# EAGLE schematic Battery Shield (EAGLE 6.3)
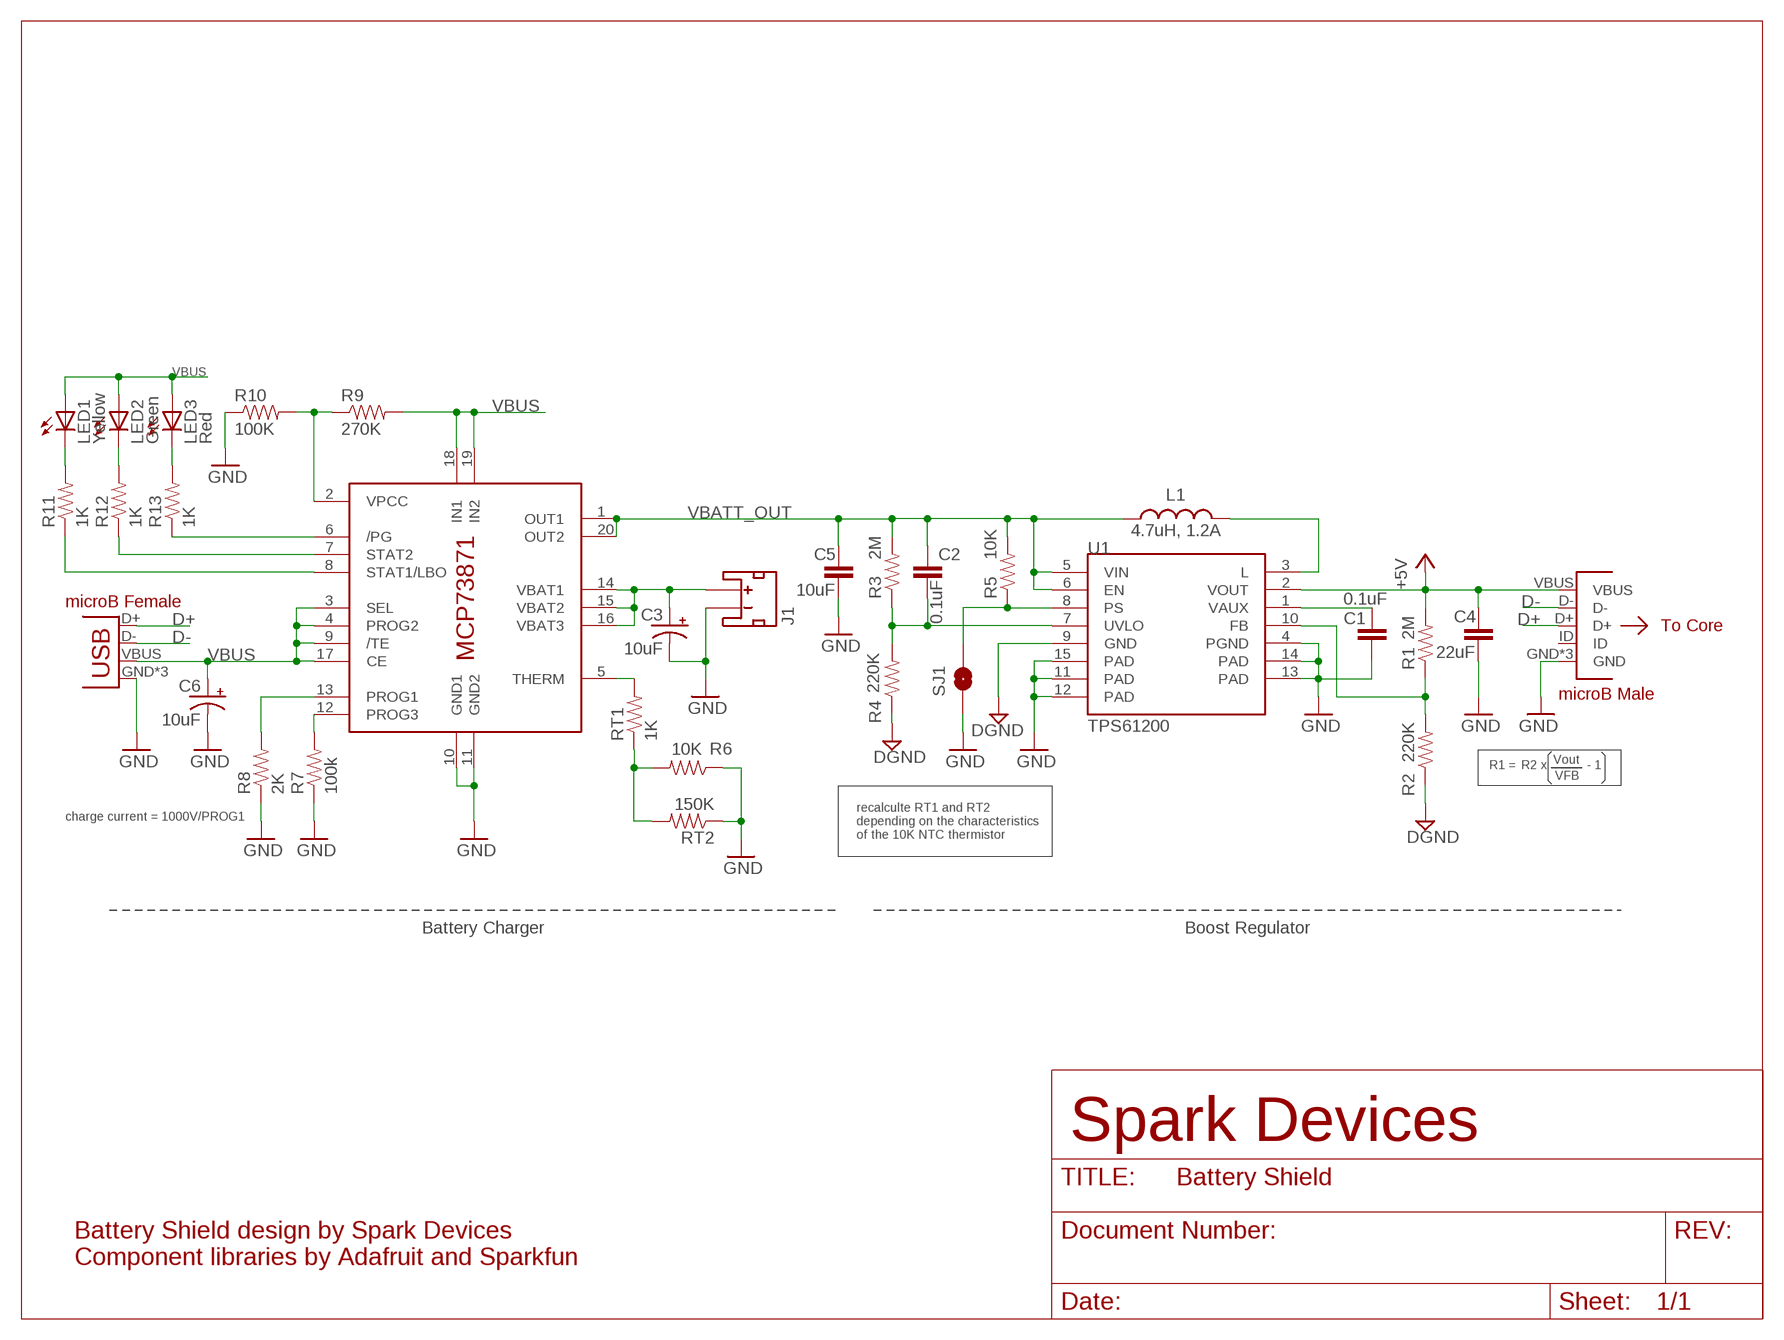
[diagram p0: schematic, sheet 1]

## Parts
C1  0.1uF  CAP0402-CAP  [0402-CAP]
C2  0.1uF  CAP0402-CAP  [0402-CAP]
C3  10uF  10UF-16V-10%(TANT)  [EIA3216]
C4  22uF  CAP0805  [0805]
C5  10uF  CAP1206  [1206]
C6  10uF  10UF-16V-10%(TANT)  [EIA3216]
IC1  MCP73871  [QFN20]
J1  JST_2MM_MALE  [JST-2-SMD]
JP1  USBUSB-MICROB-SLOT-HOLE  [USB-MICROB-SLOT-HOLE]
L1  4.7uH, 1.2A  INDUCTOR.  [CDRH2D09]
LED1  Yellow  LED0603  [LED-0603]
LED2  Green  LED0603  [LED-0603]
LED3  Red  LED0603  [LED-0603]
R1  2M  RESISTOR0402-RES  [0402-RES]
R2  220K  RESISTOR0402-RES  [0402-RES]
R3  2M  RESISTOR0402-RES  [0402-RES]
R4  220K  RESISTOR0402-RES  [0402-RES]
R5  10K  RESISTOR0402-RES  [0402-RES]
R6  10K  RESISTOR0402-RES  [0402-RES]
R7  100k  RESISTOR0402-RES  [0402-RES]
R8  2K  RESISTOR0402-RES  [0402-RES]
R9  270K  RESISTOR0402-RES  [0402-RES]
R10  100K  RESISTOR0402-RES  [0402-RES]
R11  1K  RESISTOR0402-RES  [0402-RES]
R12  1K  RESISTOR0402-RES  [0402-RES]
R13  1K  RESISTOR0402-RES  [0402-RES]
RT1  1K  RESISTOR0402-RES  [0402-RES]
RT2  150K  RESISTOR0402-RES  [0402-RES]
SJ1  SOLDERJUMPERNO  [SJ_2S-NO]
U1  TPS61200  [QFN-10_PAD]
U$1  USB_MALE  [USB-MICROB-MALE-SANDWICH]

## Nets
+5V: C4.1 R1.2 U1.2(VOUT) U$1.VBUS
D+: JP1.D+ U$1.D+
D-: JP1.D- U$1.D-
DGND: R2.1 R4.1 U1.9(GND)
GND: C1.2 C3.C(-) C4.2 C5.2 C6.C(-) IC1.10(GND1) IC1.11(GND2) J1.1(-) JP1.GND JP1.MT1(GND) JP1.MT2(GND) R6.1 R7.1 R8.1 R10.1 RT2.1 SJ1.1 U1.4(PGND) U1.11(PAD) U1.12(PAD) U1.13(PAD) U1.14(PAD) U1.15(PAD) U$1.GND U$1.GNDPAD1(GND) U$1.GNDPAD2(GND)
N$1: L1.P$2 U1.3(L)
N$2: C1.1 U1.1(VAUX)
N$3: C2.2 R3.1 R4.2 U1.7(UVLO)
N$4: R1.1 R2.2 U1.10(FB)
N$5: C3.A(+) IC1.14(VBAT1) IC1.15(VBAT2) IC1.16(VBAT3) J1.2(+)
N$6: IC1.8(STAT1/LBO) R11.1
N$7: R6.2 RT1.1 RT2.2
N$8: LED1.C R11.2
N$9: IC1.5(THERM) RT1.2
N$10: LED2.C R12.2
N$11: IC1.12(PROG3) R7.2
N$12: IC1.2(VPCC) R9.1 R10.2
N$13: IC1.13(PROG1) R8.2
N$14: IC1.7(STAT2) R12.1
N$15: IC1.6(/PG) R13.1
N$16: LED3.C R13.2
N$19: R5.1 SJ1.2 U1.8(PS)
VBATT_OUT: C2.1 C5.1 IC1.1(OUT1) IC1.20(OUT2) L1.P$1 R3.2 R5.2 U1.5(VIN) U1.6(EN)
VBUS: C6.A(+) IC1.3(SEL) IC1.4(PROG2) IC1.9(/TE) IC1.17(CE) IC1.18(IN1) IC1.19(IN2) JP1.VBUS LED1.A LED2.A LED3.A R9.2
Unconnected: J1.NC1(PAD1) J1.NC2(PAD2) U$1.ID

## Notes on the sheet
- microB Female
- To Core
- microB Male
- Vout
- R1 = | R2 | x | - 1
- VFB
- charge current = 1000V/PROG1
- recalculte RT1 and RT2
  depending on the characteristics
  of the 10K NTC thermistor
- Battery Charger | Boost Regulator
- Spark Devices
- Battery Shield design by Spark Devices
  Component libraries by Adafruit and Sparkfun

## Library data of the parts
C1 C2 C4 = SparkFun-Passives:CAP: Capacitor Standard 0603 ceramic capacitor, and 0.1" leaded capacitor.
C3 C6 = SparkFun-Capacitors:10UF-16V-10%(TANT): CAP-00811 1206/EIA-3216 Tantalum capacitor; PROD_ID: CAP-00811
C5 = SparkFun-Capacitors:CAP: Capacitor Standard 0603 ceramic capacitor, and 0.1" leaded capacitor.
IC1 = adafruit:MCP73871
J1 = SparkFun-Connectors:JST_2MM_MALE: Mates to single-cell LiPo batteries. CONN-08352; PROD_ID: CONN-08352
JP1 = Spark:USB
L1 = SparkFun-Passives:INDUCTOR: Inductors Basic Inductor/Choke - 0603 and 1206. Footprints are not proven and vary greatly between part numbers. SRN6045- 33uH, 20% 1.4A
LED1-LED3 = SparkFun-LED:LED: LEDs Standard schematic elements and footprints for 5mm, 3mm, 1206, and 0603 sized LEDs. 5mm - Spark Fun Electronics SKU : COM-00529 (and others)
R1-R13 RT1 RT2 = SparkFun-Passives:RESISTOR: Resistor Basic schematic elements and footprints for 0603, 1206, and PTH resistors.
SJ1 = SparkFun-Passives:SOLDERJUMPER: Solder Jumper Standard SMD solder jumper. Used to automate production. Two varients : Normally Open and Normally Closed are the same, but have different paste layers. NC will have a large amount of paste and should jumper during reflow.
U1 = SparkFun-PowerIC:TPS61200: DC to DC Booster IC-10035; PROD_ID: IC-10035
U$1 = Spark:USB_MALE